# Altium schematic sheet HoloCubicMCU_211230.SchDoc
size A4
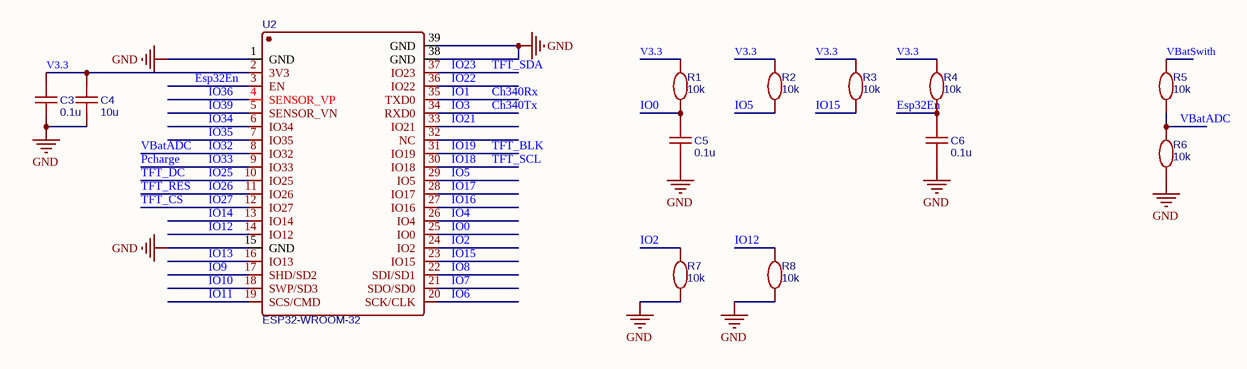
[diagram p0: HoloCubicMCU_211230.SchDoc]

## Parts
C3  0.1u  [C0603]
C4  10u  [C0603]
C5  0.1u  [C0603]
C6  0.1u  [C0603]
R1  10k  [R0603]
R2  10k  [R0603]
R3  10k  [R0603]
R4  10k  [R0603]
R5  10k  [R0603]
R6  10k  [R0603]
R7  10k  [R0603]
R8  10k  [R0603]
U2  ESP32-WROOM-32  [WIFIM-SMD_ESP-32S]

## Nets
GND: C3.1 C4.1 C5.1 C6.1 R6.1 R7.1 R8.1 U2.1(GND) U2.15(GND) U2.38(GND) U2.39(GND)
Ch340Rx: U2.35(TXD0)  [also labelled IO1]
Ch340Tx: U2.34(RXD0)  [also labelled IO3]
Esp32En: C6.2 R4.1 U2.3(EN)
IO0: C5.2 R1.1 U2.25(IO0)
IO2: R7.2 U2.24(IO2)
IO4: U2.26(IO4)
IO5: R2.1 U2.29(IO5)
IO6: U2.20(SCK/CLK)
IO7: U2.21(SDO/SD0)
IO8: U2.22(SDI/SD1)
IO9: U2.17(SHD/SD2)
IO10: U2.18(SWP/SD3)
IO11: U2.19(SCS/CMD)
IO12: R8.2 U2.14(IO12)
IO13: U2.16(IO13)
IO14: U2.13(IO14)
IO15: R3.1 U2.23(IO15)
IO16: U2.27(IO16)
IO17: U2.28(IO17)
IO18: U2.30(IO18)  [also labelled TFT_SCL]
IO19: U2.31(IO19)  [also labelled TFT_BLK]
IO21: U2.33(IO21)
IO22: U2.36(IO22)
IO23: U2.37(IO23)  [also labelled TFT_SDA]
IO25: U2.10(IO25)  [also labelled TFT_DC]
IO26: U2.11(IO26)  [also labelled TFT_RES]
IO27: U2.12(IO27)  [also labelled TFT_CS]
IO32: R5.1 R6.2 U2.8(IO32)  [also labelled VBatADC]
IO33: U2.9(IO33)  [also labelled Pcharge]
IO34: U2.6(IO34)
IO35: U2.7(IO35)
IO36: U2.4(SENSOR_VP)
IO39: U2.5(SENSOR_VN)
V3.3: C3.2 C4.2 R1.2 R2.2 R3.2 R4.2 U2.2(3V3)
VBatSwith: R5.2

Not connected (* = marked no-connect by the designer): U2 32(NC)

## Library data of the parts
C3-C6 = 0.1u: nameAlias: Value(F); Contributor: LCEDA_Lib; spicePre: C; spiceSymbolName: C_0603_US
R1-R8 = 10k: Contributor: LCEDA_Lib; spicePre: R; spiceSymbolName: R_0603_EU
U2 = ESP32-WROOM-32: BOM_Manufacturer: Espressif Systems; Contributor: LCSC; BOM_Supplier: LCSC; BOM_Supplier Part: C82899; BOM_Manufacturer Part: ESP32-WROOM-32; BOM_JLCPCB Part Class: Extended Part; spicePre: U; spiceSymbolName: ESP32-WROOM-32